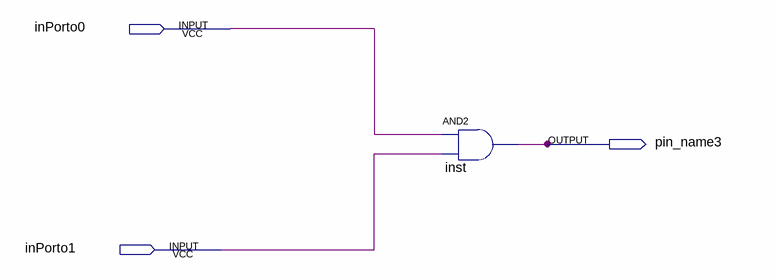
[diagram p0: schematic sheet]
// Quartus schematic GateDemo.bdf as structural Verilog: 1 symbols, 3 pins
module GateDemo (
  input  inPorto0,
  input  inPorto1,
  output pin_name3
);

  and inst (pin_name3, inPorto0, inPorto1);
endmodule
